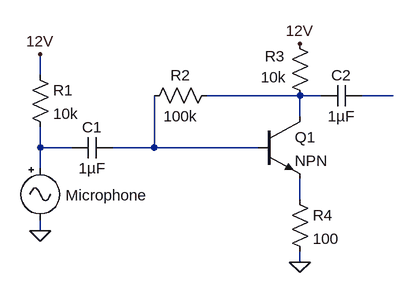
[diagram p0: schematic Microphone_Driver.asc]
Microphone_Driver.asc, the LTspice schematic file:
Version 4
SHEET 1 880 680
WIRE 160 208 160 176
WIRE 560 240 416 240
WIRE 592 240 560 240
WIRE 704 240 656 240
WIRE 560 272 560 240
WIRE 160 320 160 288
WIRE 208 320 160 320
WIRE 336 320 336 240
WIRE 336 320 272 320
WIRE 496 320 336 320
WIRE 160 352 160 320
WIRE 560 400 560 368
WIRE 160 448 160 432
WIRE 560 496 560 480
FLAG 160 448 0
FLAG 160 176 12V
FLAG 560 160 12V
FLAG 560 496 0
SYMBOL res 144 192 R0
SYMATTR InstName R1
SYMATTR Value 10k
SYMBOL Misc\\signal 160 336 R0
WINDOW 0 39 57 Left 2
SYMATTR InstName Microphone
SYMATTR Value ""
SYMBOL cap 272 304 R90
WINDOW 0 0 32 VBottom 2
WINDOW 3 32 32 VTop 2
SYMATTR InstName C1
SYMATTR Value 1µF
SYMBOL res 432 224 R90
WINDOW 0 0 56 VBottom 2
WINDOW 3 32 56 VTop 2
SYMATTR InstName R2
SYMATTR Value 100k
SYMBOL npn 496 272 R0
SYMATTR InstName Q1
SYMBOL res 544 144 R0
WINDOW 0 -38 35 Left 2
WINDOW 3 -44 68 Left 2
SYMATTR InstName R3
SYMATTR Value 10k
SYMBOL cap 656 224 R90
WINDOW 0 0 32 VBottom 2
WINDOW 3 32 32 VTop 2
SYMATTR InstName C2
SYMATTR Value 1µF
SYMBOL res 544 384 R0
SYMATTR InstName R4
SYMATTR Value 100

The netlist it stands for:
* Microphone_Driver.asc
R1 12V N003 10k
V§Microphone N003 0
C1 N004 N003 1µF
R2 N001 N004 100k
Q1 N001 N004 N005 0 NPN
R3 12V N001 10k
C2 N002 N001 1µF
R4 N005 0 100
.model NPN NPN
.model PNP PNP
.lib standard.bjt
.backanno
.end